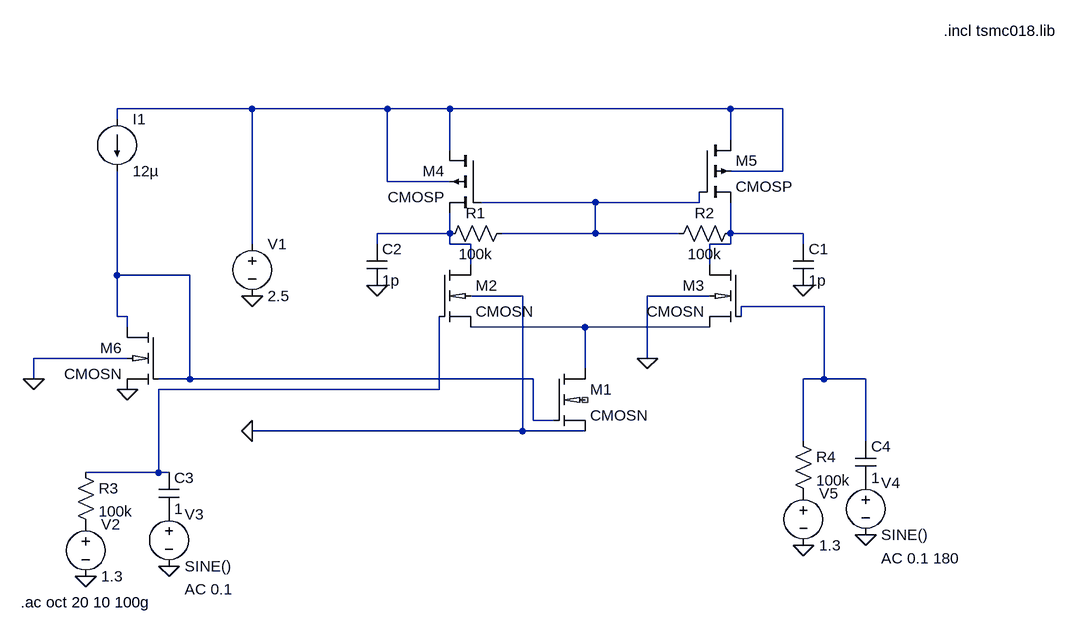
[diagram p0: schematic Draft1.asc]
Draft1.asc, the LTspice schematic file:
Version 4
SHEET 1 1148 680
WIRE -112 -144 -320 -144
WIRE 96 -144 -112 -144
WIRE 192 -144 96 -144
WIRE 624 -144 192 -144
WIRE 704 -144 624 -144
WIRE -320 -128 -320 -144
WIRE 624 -96 624 -144
WIRE 192 -80 192 -144
WIRE 704 -48 704 -144
WIRE 704 -48 624 -48
WIRE 96 -32 96 -144
WIRE 192 -32 96 -32
WIRE 416 0 240 0
WIRE 576 0 576 -16
WIRE 576 0 416 0
WIRE 192 48 192 16
WIRE 192 48 80 48
WIRE 416 48 416 0
WIRE 416 48 272 48
WIRE 544 48 416 48
WIRE 624 48 624 0
WIRE 736 48 624 48
WIRE -112 64 -112 -144
WIRE 80 64 80 48
WIRE 192 64 192 48
WIRE 224 64 192 64
WIRE 624 64 624 48
WIRE 624 64 592 64
WIRE 736 64 736 48
WIRE 224 96 224 64
WIRE 592 96 592 64
WIRE -320 112 -320 -48
WIRE -208 112 -320 112
WIRE 304 144 224 144
WIRE 592 144 496 144
WIRE 768 160 640 160
WIRE -320 176 -320 112
WIRE -304 176 -320 176
WIRE 640 176 640 160
WIRE -304 192 -304 176
WIRE 400 192 224 192
WIRE 592 192 400 192
WIRE -304 240 -448 240
WIRE 496 240 496 144
WIRE 400 256 400 192
WIRE -448 272 -448 240
WIRE -208 272 -208 112
WIRE -208 272 -256 272
WIRE 320 272 -208 272
WIRE 768 272 768 160
WIRE 768 272 736 272
WIRE 832 272 768 272
WIRE 176 288 176 176
WIRE 176 288 -256 288
WIRE 320 336 320 272
WIRE 352 336 320 336
WIRE 304 352 304 144
WIRE 304 352 -112 352
WIRE 400 352 304 352
WIRE 736 368 736 272
WIRE 832 368 832 272
WIRE -256 416 -256 288
WIRE -256 416 -368 416
WIRE -240 416 -256 416
FLAG -112 144 0
FLAG -112 352 0
FLAG 496 240 0
FLAG 736 128 0
FLAG 80 128 0
FLAG -304 288 0
FLAG -448 272 0
FLAG -368 576 0
FLAG -240 560 0
FLAG 832 512 0
FLAG 736 528 0
SYMBOL voltage -112 48 R0
WINDOW 123 0 0 Left 0
WINDOW 39 0 0 Left 0
SYMATTR InstName V1
SYMATTR Value 2.5
SYMBOL cmosn 352 256 R0
SYMATTR InstName M1
SYMATTR Value2 l=0.25u w=5u
SYMBOL cmosn 176 96 R0
SYMATTR InstName M2
SYMATTR Value2 l=0.25u w=2.5u
SYMBOL cmosn 640 96 M0
SYMATTR InstName M3
SYMATTR Value2 l=0.25u w=2.5u
SYMBOL cmosp 240 -80 M0
SYMATTR InstName M4
SYMATTR Value2 l=0.25u w=10u
SYMBOL cmosp 576 -96 R0
SYMATTR InstName M5
SYMATTR Value2 l=0.25u w=10u
SYMBOL res 288 32 R90
WINDOW 0 0 56 VBottom 0
WINDOW 3 32 56 VTop 0
SYMATTR InstName R1
SYMATTR Value 100k
SYMBOL res 640 32 R90
WINDOW 0 0 56 VBottom 0
WINDOW 3 32 56 VTop 0
SYMATTR InstName R2
SYMATTR Value 100k
SYMBOL cap 720 64 R0
SYMATTR InstName C1
SYMATTR Value 1p
SYMBOL cap 64 64 R0
SYMATTR InstName C2
SYMATTR Value 1p
SYMBOL cmosn -256 192 M0
SYMATTR InstName M6
SYMATTR Value2 l=0.25u w=0.5u
SYMBOL current -320 -128 R0
WINDOW 123 0 0 Left 0
WINDOW 39 0 0 Left 0
SYMATTR InstName I1
SYMATTR Value 12µ
SYMBOL res -384 400 R0
SYMATTR InstName R3
SYMATTR Value 100k
SYMBOL cap -256 416 R0
SYMATTR InstName C3
SYMATTR Value 1
SYMBOL voltage -368 480 R0
WINDOW 123 0 0 Left 0
WINDOW 39 0 0 Left 0
SYMATTR InstName V2
SYMATTR Value 1.3
SYMBOL voltage -240 464 R0
WINDOW 123 24 132 Left 0
WINDOW 39 0 0 Left 0
SYMATTR InstName V3
SYMATTR Value SINE()
SYMATTR Value2 AC 0.1
SYMBOL cap 816 368 R0
SYMATTR InstName C4
SYMATTR Value 1
SYMBOL voltage 832 416 R0
WINDOW 123 24 132 Left 0
WINDOW 39 0 0 Left 0
SYMATTR InstName V4
SYMATTR Value SINE()
SYMATTR Value2 AC 0.1 180
SYMBOL res 720 352 R0
SYMATTR InstName R4
SYMATTR Value 100k
SYMBOL voltage 736 432 R0
WINDOW 123 0 0 Left 0
WINDOW 39 0 0 Left 0
SYMATTR InstName V5
SYMATTR Value 1.3
TEXT -468 616 Left 0 !.ac oct 20 10 100g
TEXT 952 -264 Left 0 !.incl tsmc018.lib

The netlist it stands for:
* Draft1.asc
V1 N001 0 2.5
M1 N007 N005 0 NC_01 CMOSN l=0.25u w=5u
M2 N003 N008 N007 0 CMOSN l=0.25u w=2.5u
M3 N004 N006 N007 0 CMOSN l=0.25u w=2.5u
M4 N001 N002 N003 N001 CMOSP l=0.25u w=10u
M5 N001 N002 N004 N001 CMOSP l=0.25u w=10u
R1 N002 N003 100k
R2 N004 N002 100k
C1 N004 0 1p
C2 N003 0 1p
M6 N005 N005 0 0 CMOSN l=0.25u w=0.5u
I1 N001 N005 12µ
R3 N008 P001 100k
C3 N008 P002 1
V2 P001 0 1.3
V3 P002 0 SINE() AC 0.1
C4 N006 P003 1
V4 P003 0 SINE() AC 0.1 180
R4 N006 P004 100k
V5 P004 0 1.3
.model NMOS NMOS
.model PMOS PMOS
.lib standard.mos
.ac oct 20 10 100g
.incl tsmc018.lib
.lib tsmc018.lib
.backanno
.end